# EAGLE schematic eeZeeAmp (EAGLE 7.1.0)
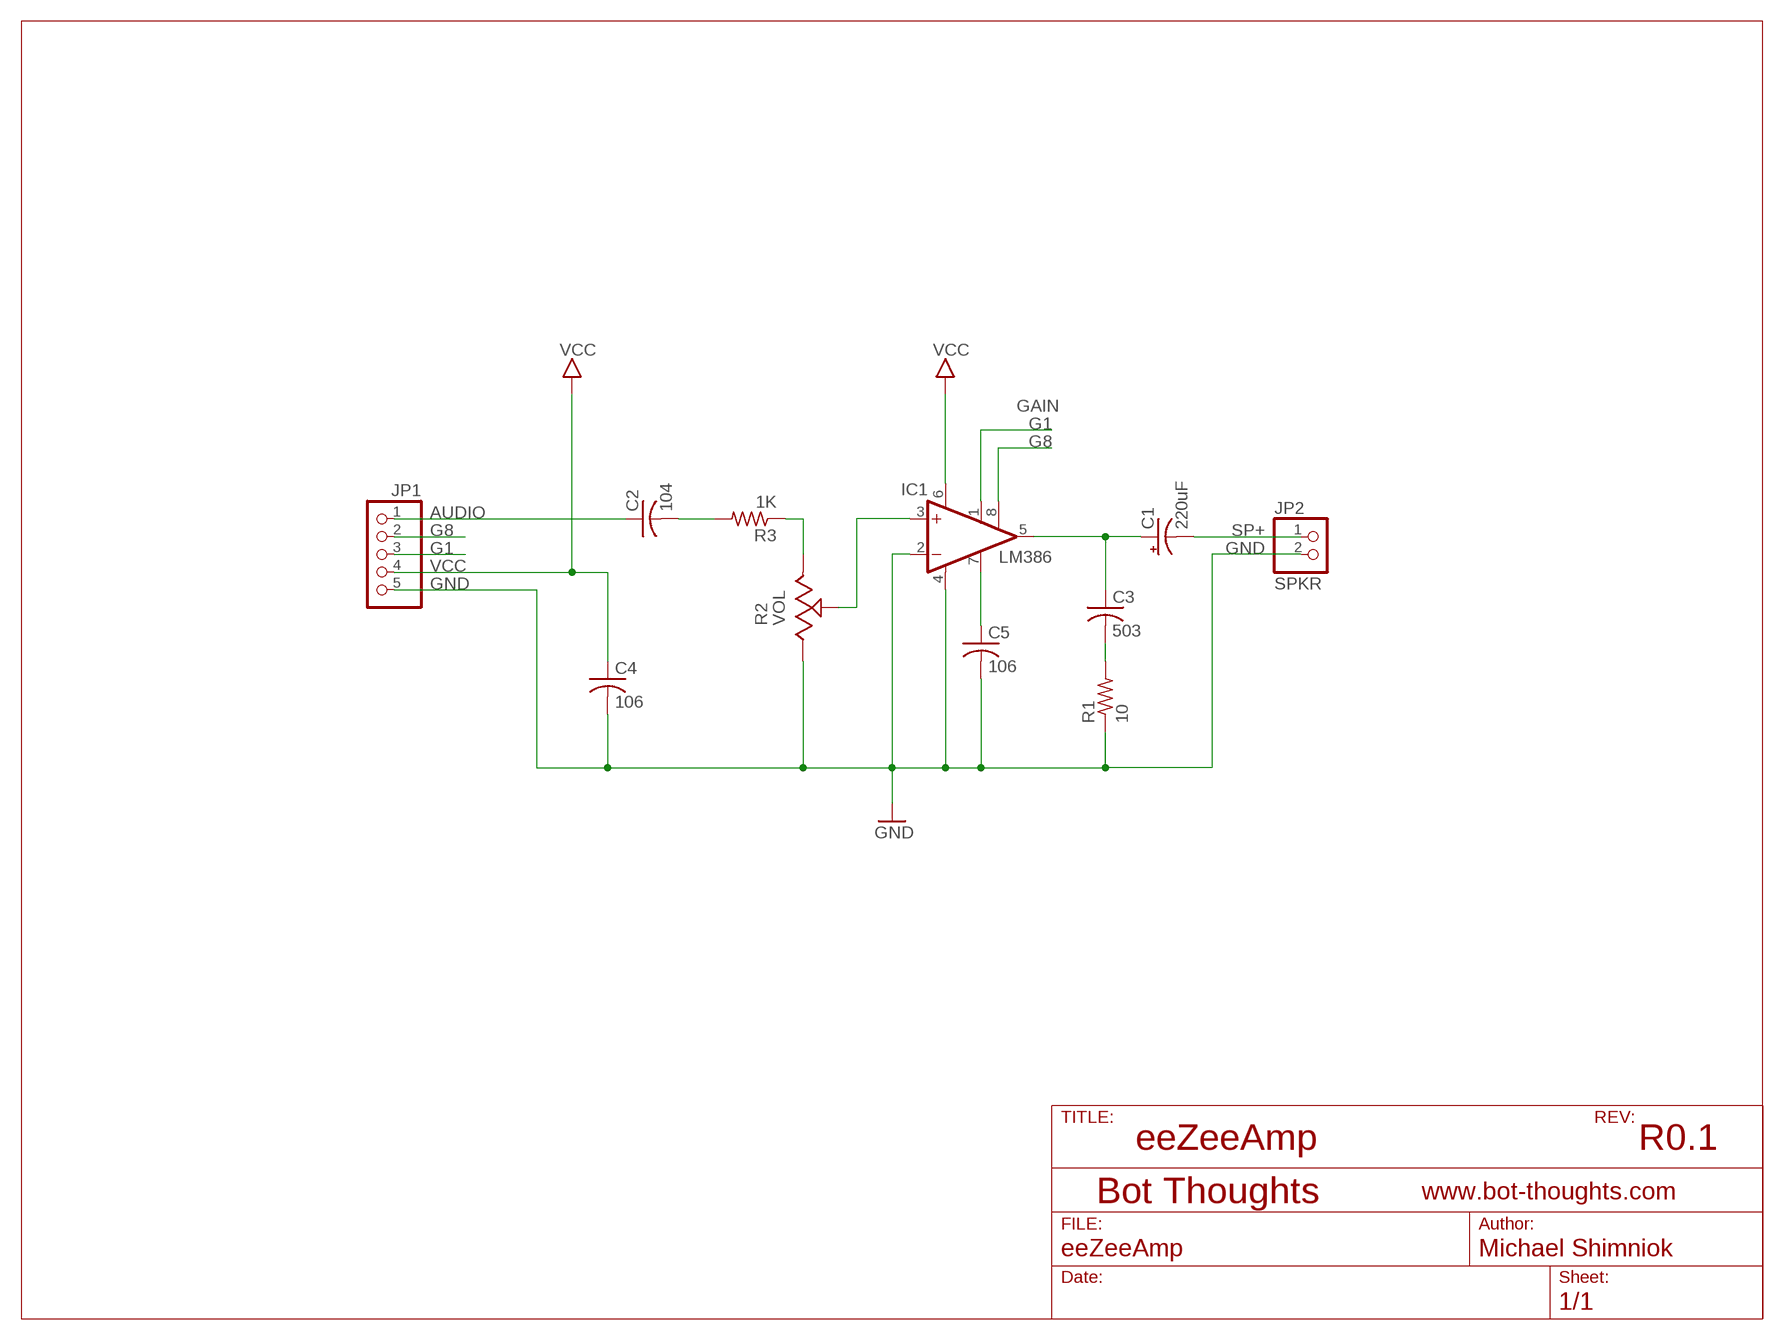
[diagram p0: schematic, sheet 1]

## Parts
C1  220uF  CPOL-USE2.5-6  [E2,5-6]
C2  104  C-USC0603  [C0603]
C3  503  C-USC0603  [C0603]
C4  106  C-USC1206  [C1206]
C5  106  C-USC1206  [C1206]
IC1  LM386  LM386M-1  [SO08]
JP1  PINHD-1X05_2.54-S  [1X05-S]
JP2  SPKR  PINHD-1X02_2.54-S  [1X02-S]
R1  10  R-US_R0603  [R0603]
R2  VOL  TRIM_US-  [OFFBOARD_POT_3]
R3  1K  R-US_R0603  [R0603]

## Nets
AUDIO: C2.1 JP1.1
G1: IC1.1(GAIN) JP1.3
G8: IC1.8(GAIN) JP1.2
GND: C4.2 C5.2 IC1.2(-IN) IC1.4(GND) JP1.5 JP2.2 R1.1 R2.P$1(A)
N$1: IC1.3(+IN) R2.P$2(S)
N$2: C2.2 R3.2
N$3: C1.+ C3.1 IC1.5(OUT)
N$4: C3.2 R1.2
N$7: C5.1 IC1.7(BYPASS)
N$8: R2.P$3(E) R3.1
SP+: C1.- JP2.1
VCC: C4.1 IC1.6(VS) JP1.4

## Notes on the sheet
- GAIN
- eeZeeAmp | R0.1

## Library data of the parts
C1 = rcl:CPOL-US: POLARIZED CAPACITOR, American symbol
C2-C5 = rcl:C-US: CAPACITOR, American symbol
IC1 = linear:LM386?-*: Low Voltage Audio Power Amplifier Source: http://cache.national.com/ds/LM/LM386.pdf
JP1 = pinhead-2:PINHD-1X05: PIN HEADER
JP2 = pinhead-2:PINHD-1X02: PIN HEADER
R1 R3 = resistor:R-US_: RESISTOR, American symbol
R2 = bt:TRIM_US-: POTENTIOMETER